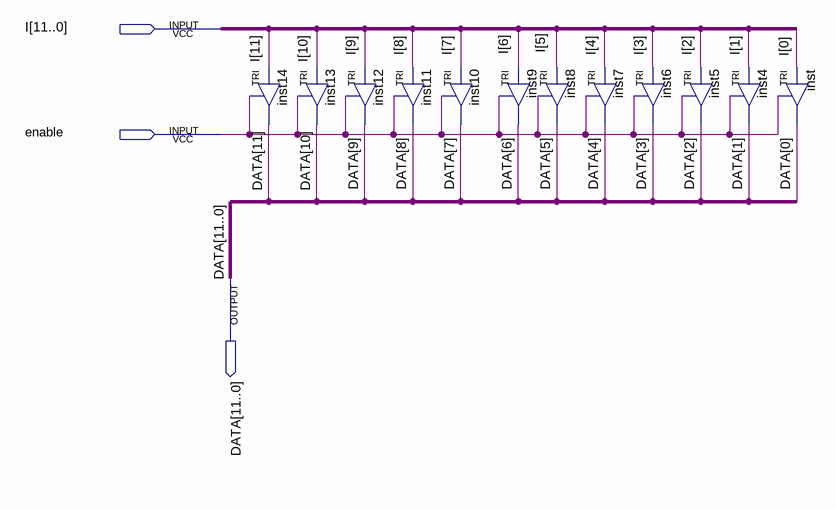
[diagram p0: schematic sheet]
// Quartus schematic Tristate12.bdf as structural Verilog: 12 symbols, 3 pins
module Tristate12 (
  input  [11:0] I,
  input  enable,
  output [11:0] DATA
);

  TRI inst14 (.IN(I[11]), .OE(enable), .OUT(DATA[11]));
  TRI inst12 (.IN(I[9]), .OE(enable), .OUT(DATA[9]));
  TRI inst13 (.IN(I[10]), .OE(enable), .OUT(DATA[10]));
  TRI inst10 (.IN(I[7]), .OE(enable), .OUT(DATA[7]));
  TRI inst11 (.IN(I[8]), .OE(enable), .OUT(DATA[8]));
  TRI inst9 (.IN(I[6]), .OE(enable), .OUT(DATA[6]));
  TRI inst7 (.IN(I[4]), .OE(enable), .OUT(DATA[4]));
  TRI inst8 (.IN(I[5]), .OE(enable), .OUT(DATA[5]));
  TRI inst6 (.IN(I[3]), .OE(enable), .OUT(DATA[3]));
  TRI inst4 (.IN(I[1]), .OE(enable), .OUT(DATA[1]));
  TRI inst5 (.IN(I[2]), .OE(enable), .OUT(DATA[2]));
  TRI inst (.IN(I[0]), .OE(enable), .OUT(DATA[0]));
endmodule
